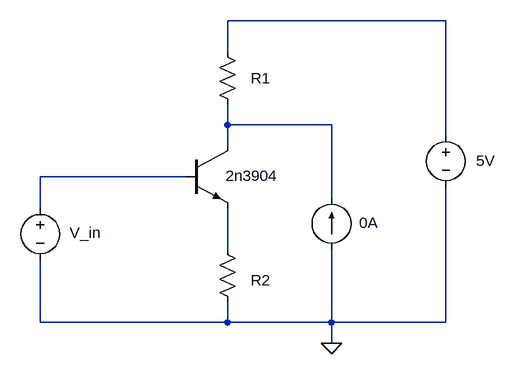
[diagram p0: schematic Experiment 4.asc]
Experiment 4.asc, the LTspice schematic file:
Version 4
SHEET 1 880 680
WIRE 688 -192 352 -192
WIRE 352 -144 352 -192
WIRE 352 -32 352 -64
WIRE 512 -32 352 -32
WIRE 688 -16 688 -192
WIRE 352 0 352 -32
WIRE 288 48 64 48
WIRE 512 80 512 -32
WIRE 64 96 64 48
WIRE 352 160 352 96
WIRE 64 272 64 176
WIRE 352 272 352 240
WIRE 352 272 64 272
WIRE 512 272 512 160
WIRE 512 272 352 272
WIRE 688 272 688 64
WIRE 688 272 512 272
WIRE 512 304 512 272
FLAG 512 304 0
SYMBOL voltage 64 80 R0
WINDOW 0 24 16 Invisible 2
WINDOW 3 45 54 Left 2
SYMATTR InstName V1
SYMATTR Value V_in
SYMBOL npn 288 0 R0
WINDOW 0 56 32 Invisible 2
WINDOW 3 61 46 Left 2
SYMATTR InstName Q1
SYMATTR Value 2n3904
SYMBOL res 336 -160 R0
WINDOW 0 36 40 Invisible 2
WINDOW 3 52 56 Left 2
SYMATTR InstName R1
SYMATTR Value R1
SYMBOL res 336 144 R0
WINDOW 0 52 63 Left 2
WINDOW 3 36 76 Invisible 2
SYMATTR InstName R2
SYMBOL voltage 688 -32 R0
WINDOW 0 24 16 Invisible 2
WINDOW 3 47 55 Left 2
SYMATTR InstName V2
SYMATTR Value 5V
SYMBOL current 512 160 R180
WINDOW 0 24 80 Invisible 2
WINDOW 3 -72 41 Left 2
SYMATTR InstName I1
SYMATTR Value 0A

The netlist it stands for:
* Experiment 4.asc
V1 N003 0 V_in
Q1 N002 N003 N004 0 2n3904
R1 N001 N002 R1
R2 N004 0 R
V2 N001 0 5V
I1 0 N002 0A
.model NPN NPN
.model PNP PNP
.lib standard.bjt
.backanno
.end